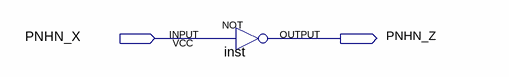
[diagram p0: schematic sheet]
// Quartus schematic Assignment5.bdf as structural Verilog: 1 symbols, 2 pins
module Assignment5 (
  input  PNHN_X,
  output PNHN_Z
);

  not inst (PNHN_Z, PNHN_X);
endmodule
